# EasyEDA schematic 2025-10-27.json

## Sheets
1 Общая схема: TITLE: Общая схема; REV: 1.0; Date: 2025-10-27; Sheet: 1/1; Drawn By: corlov; Company: Орлов К.Л.
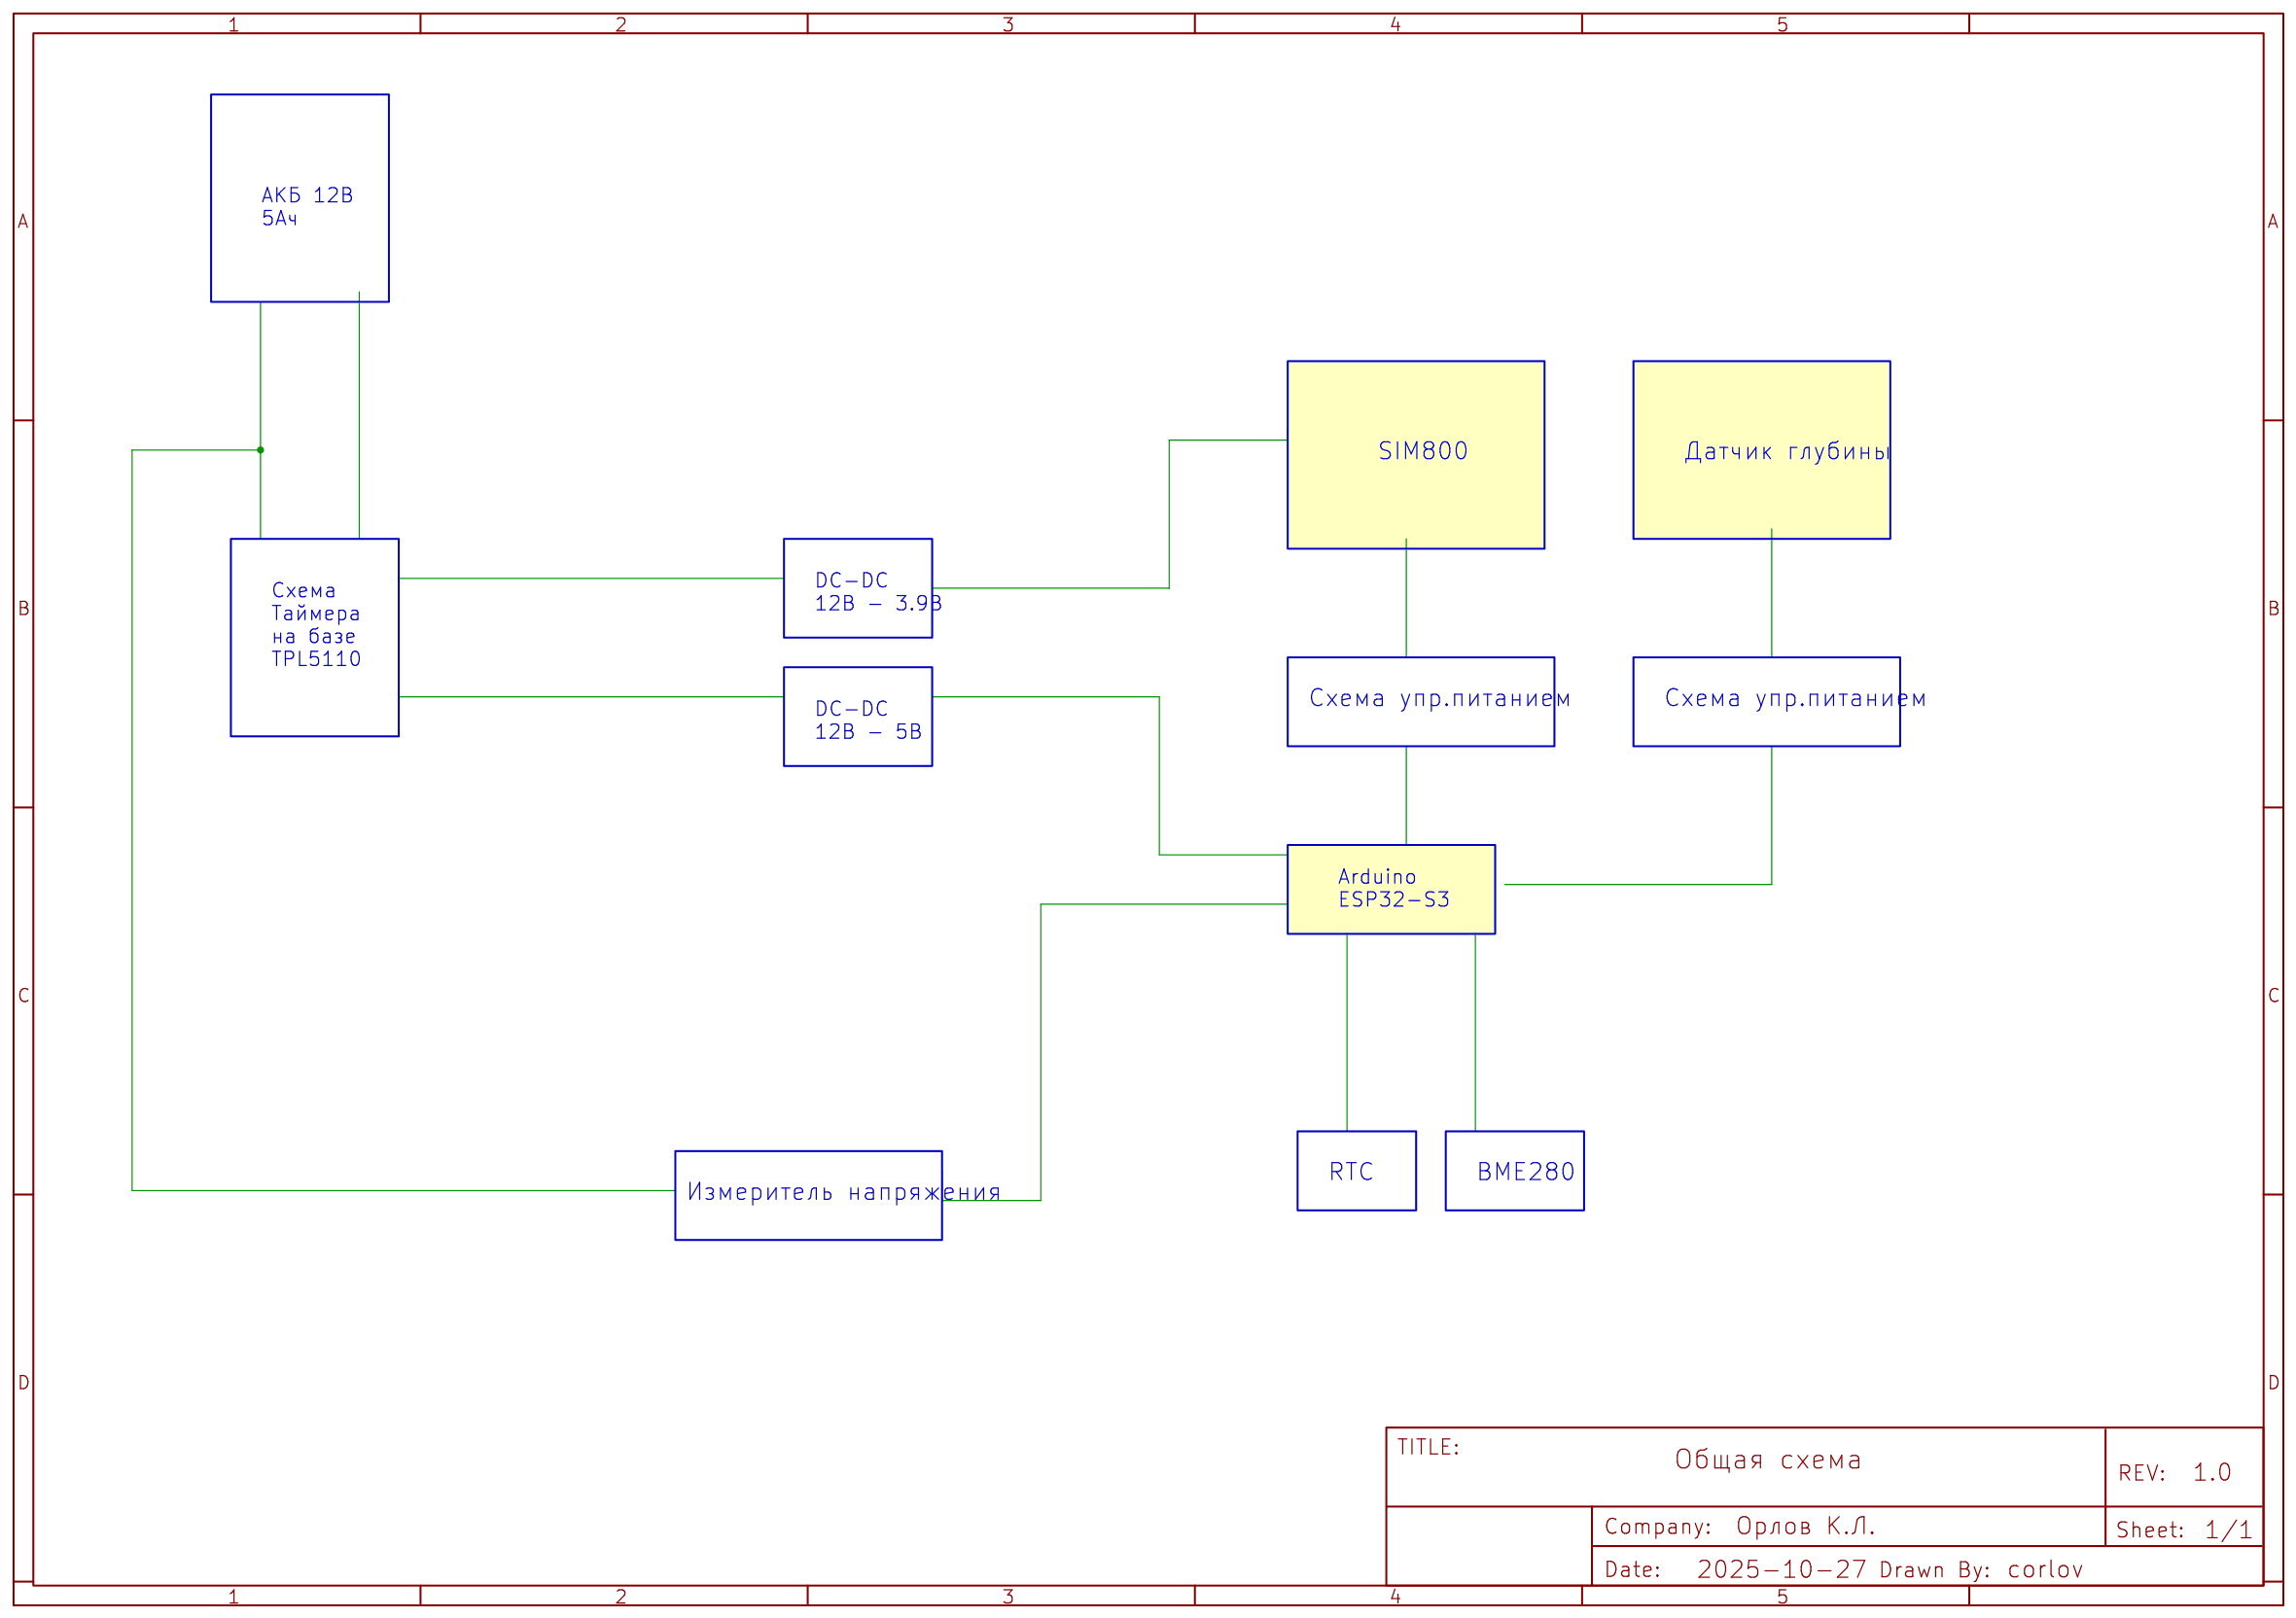
[diagram p0: Общая схема]
2 Питание по атймеру: TITLE: Управление питанием по таймеру; Company: Your Company
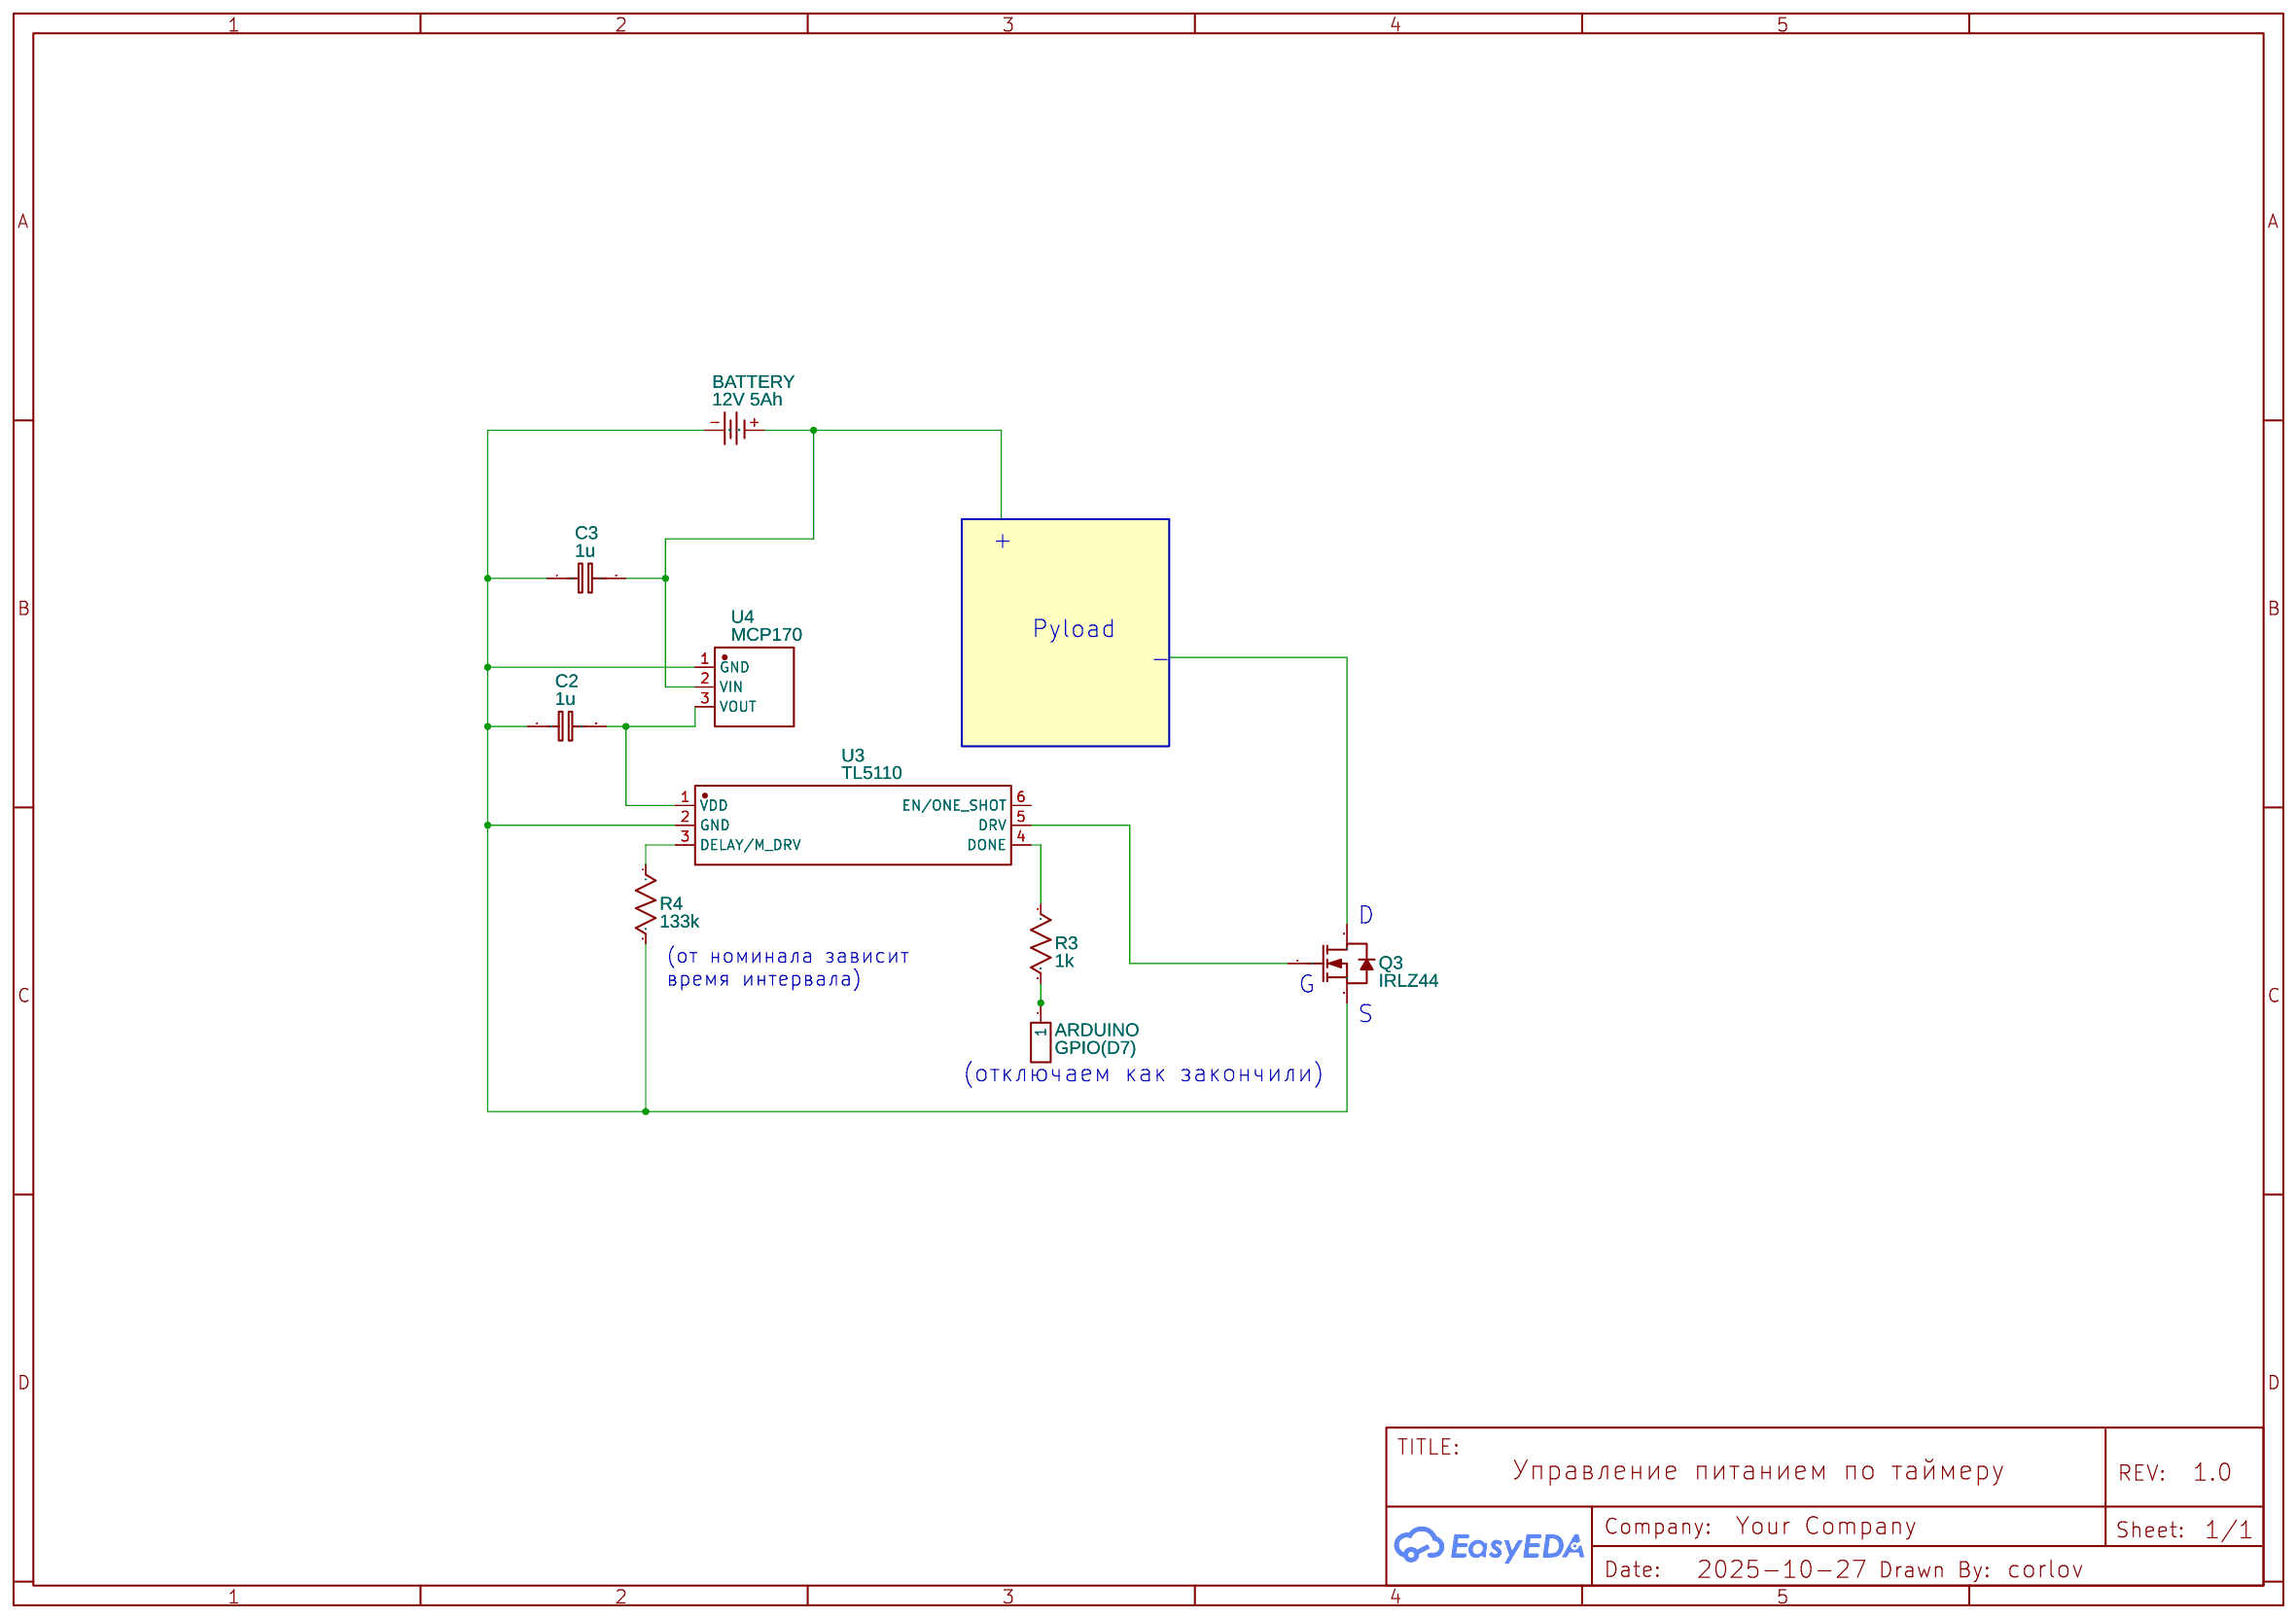
[diagram p1: Питание по атймеру]
3 PowerSwtich: TITLE: Упр. питанием модуля связи/аналоговым датчиком; Date: 2025-10-26; Company: Your Company
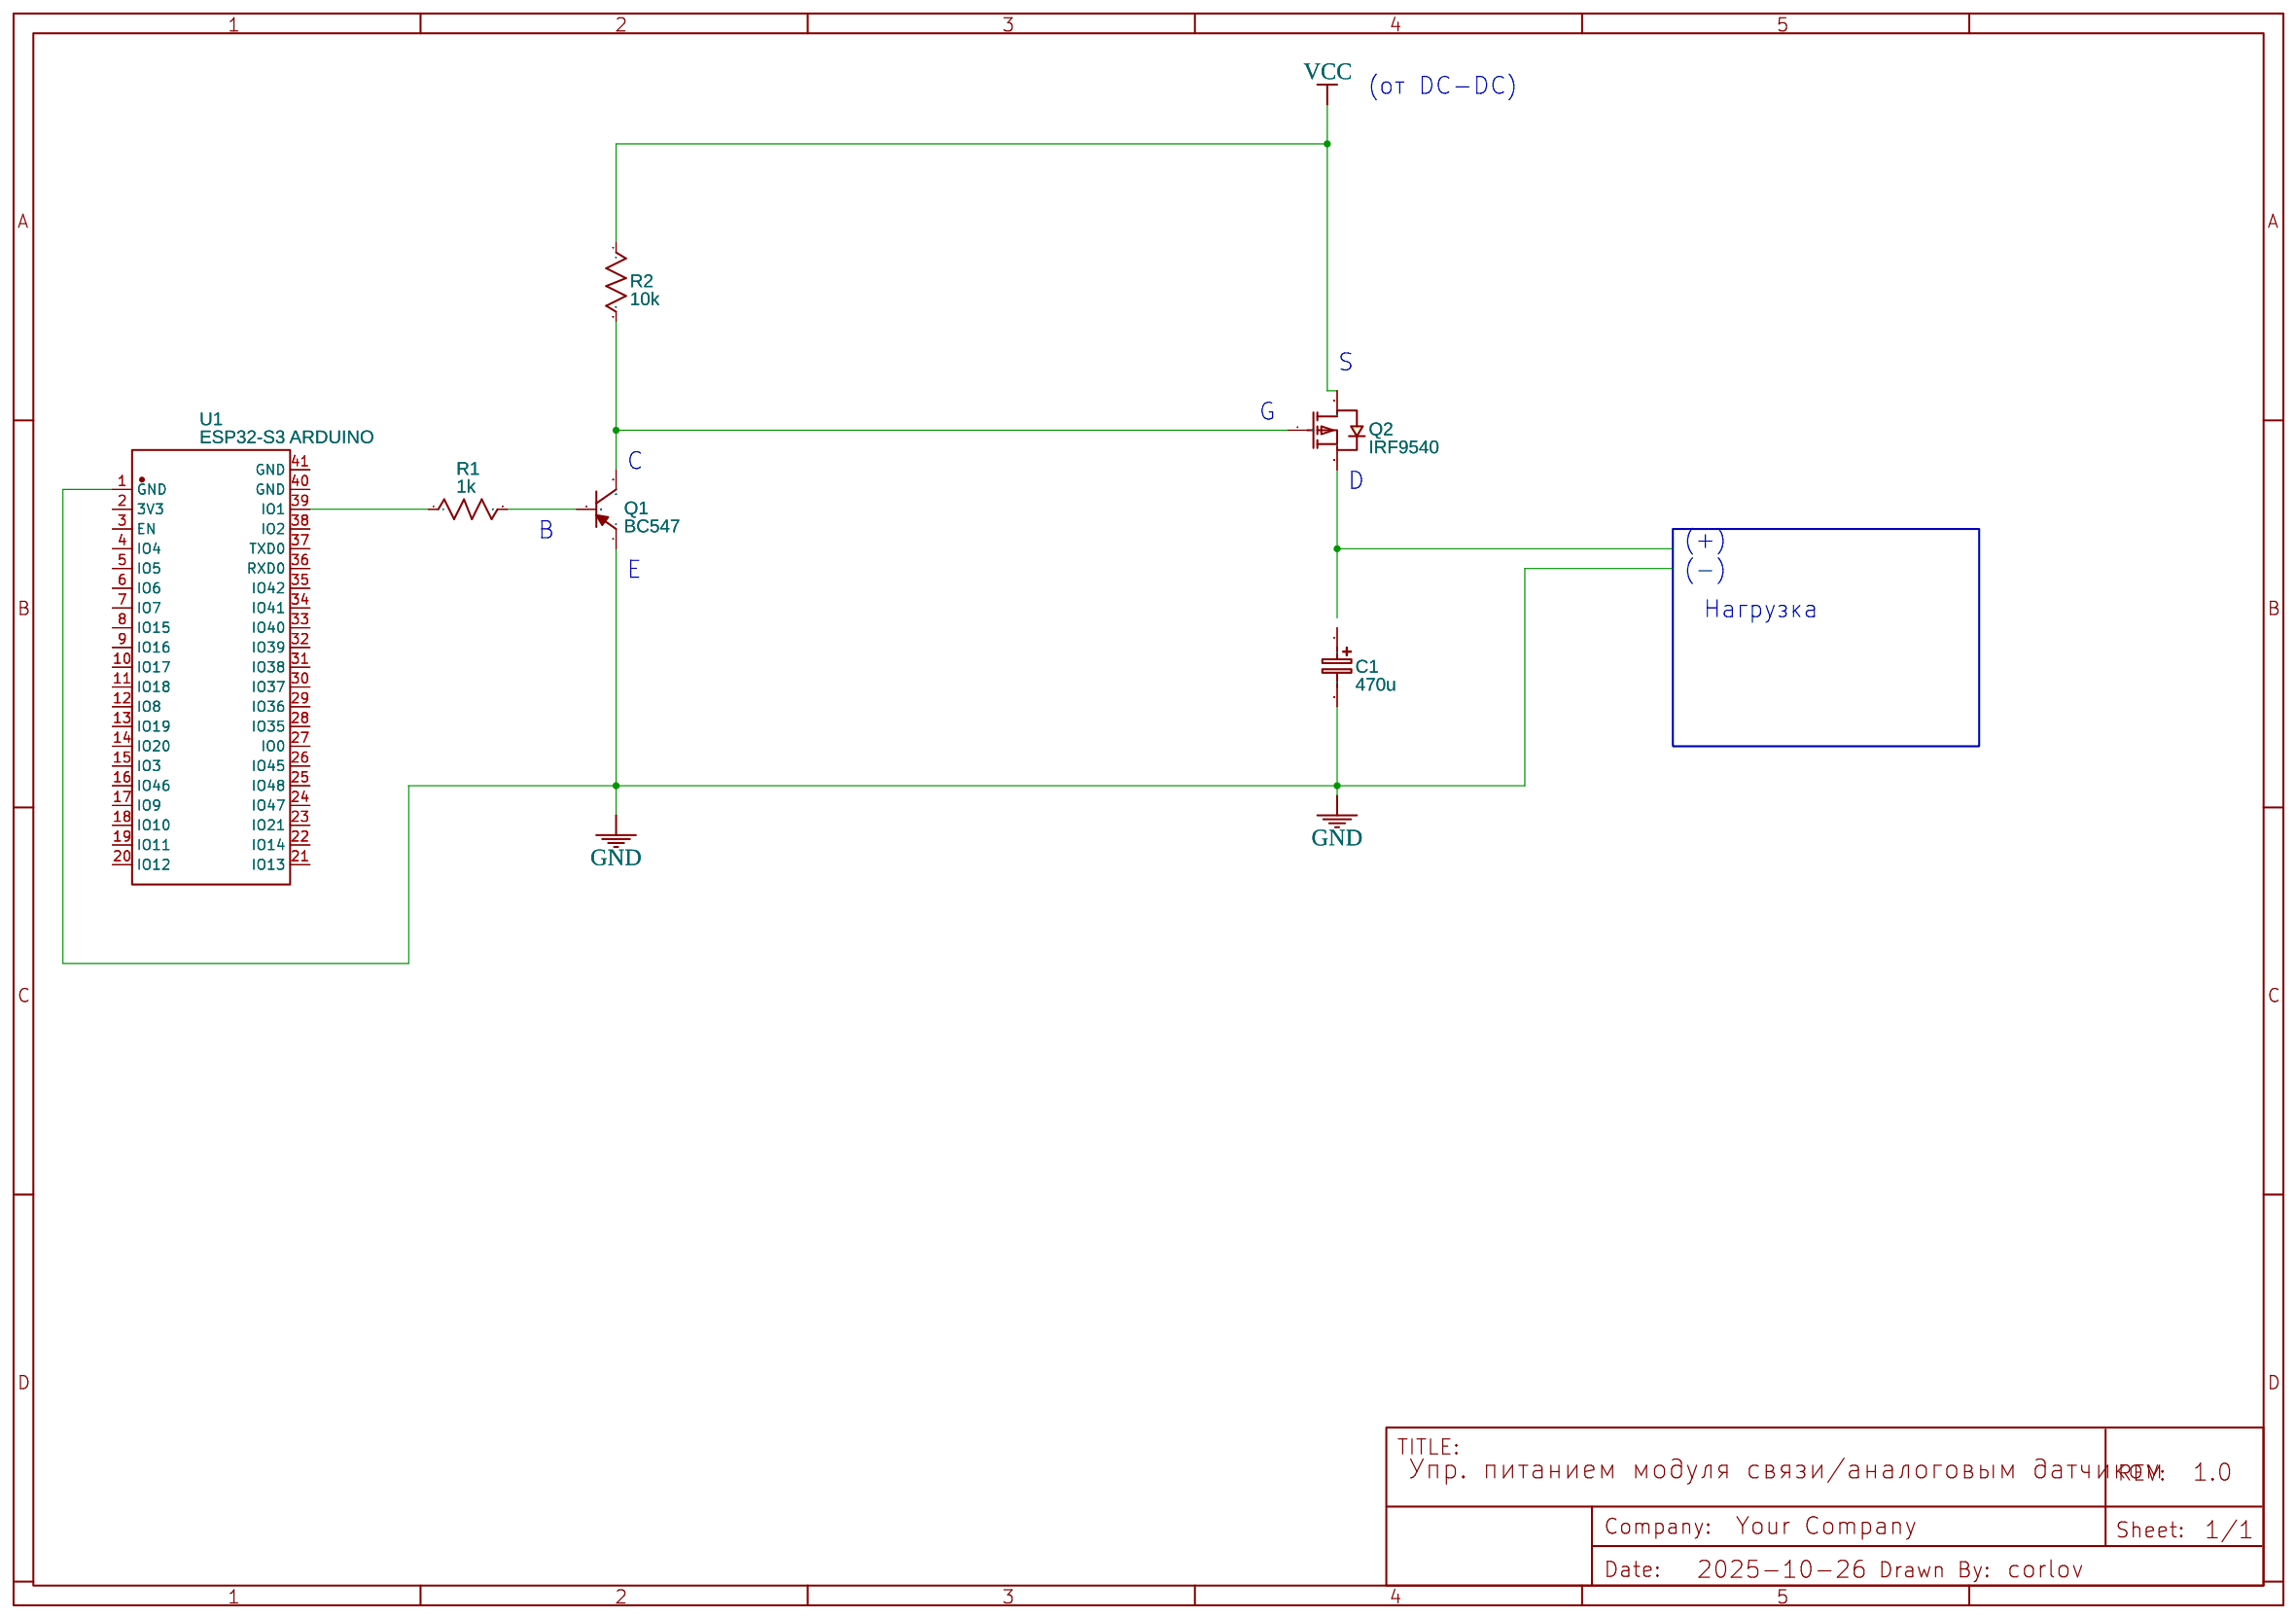
[diagram p2: PowerSwtich]
4 Отключаемый делитель: TITLE: Отключаемый полностью от питания делитель напряжения; Company: Орлов
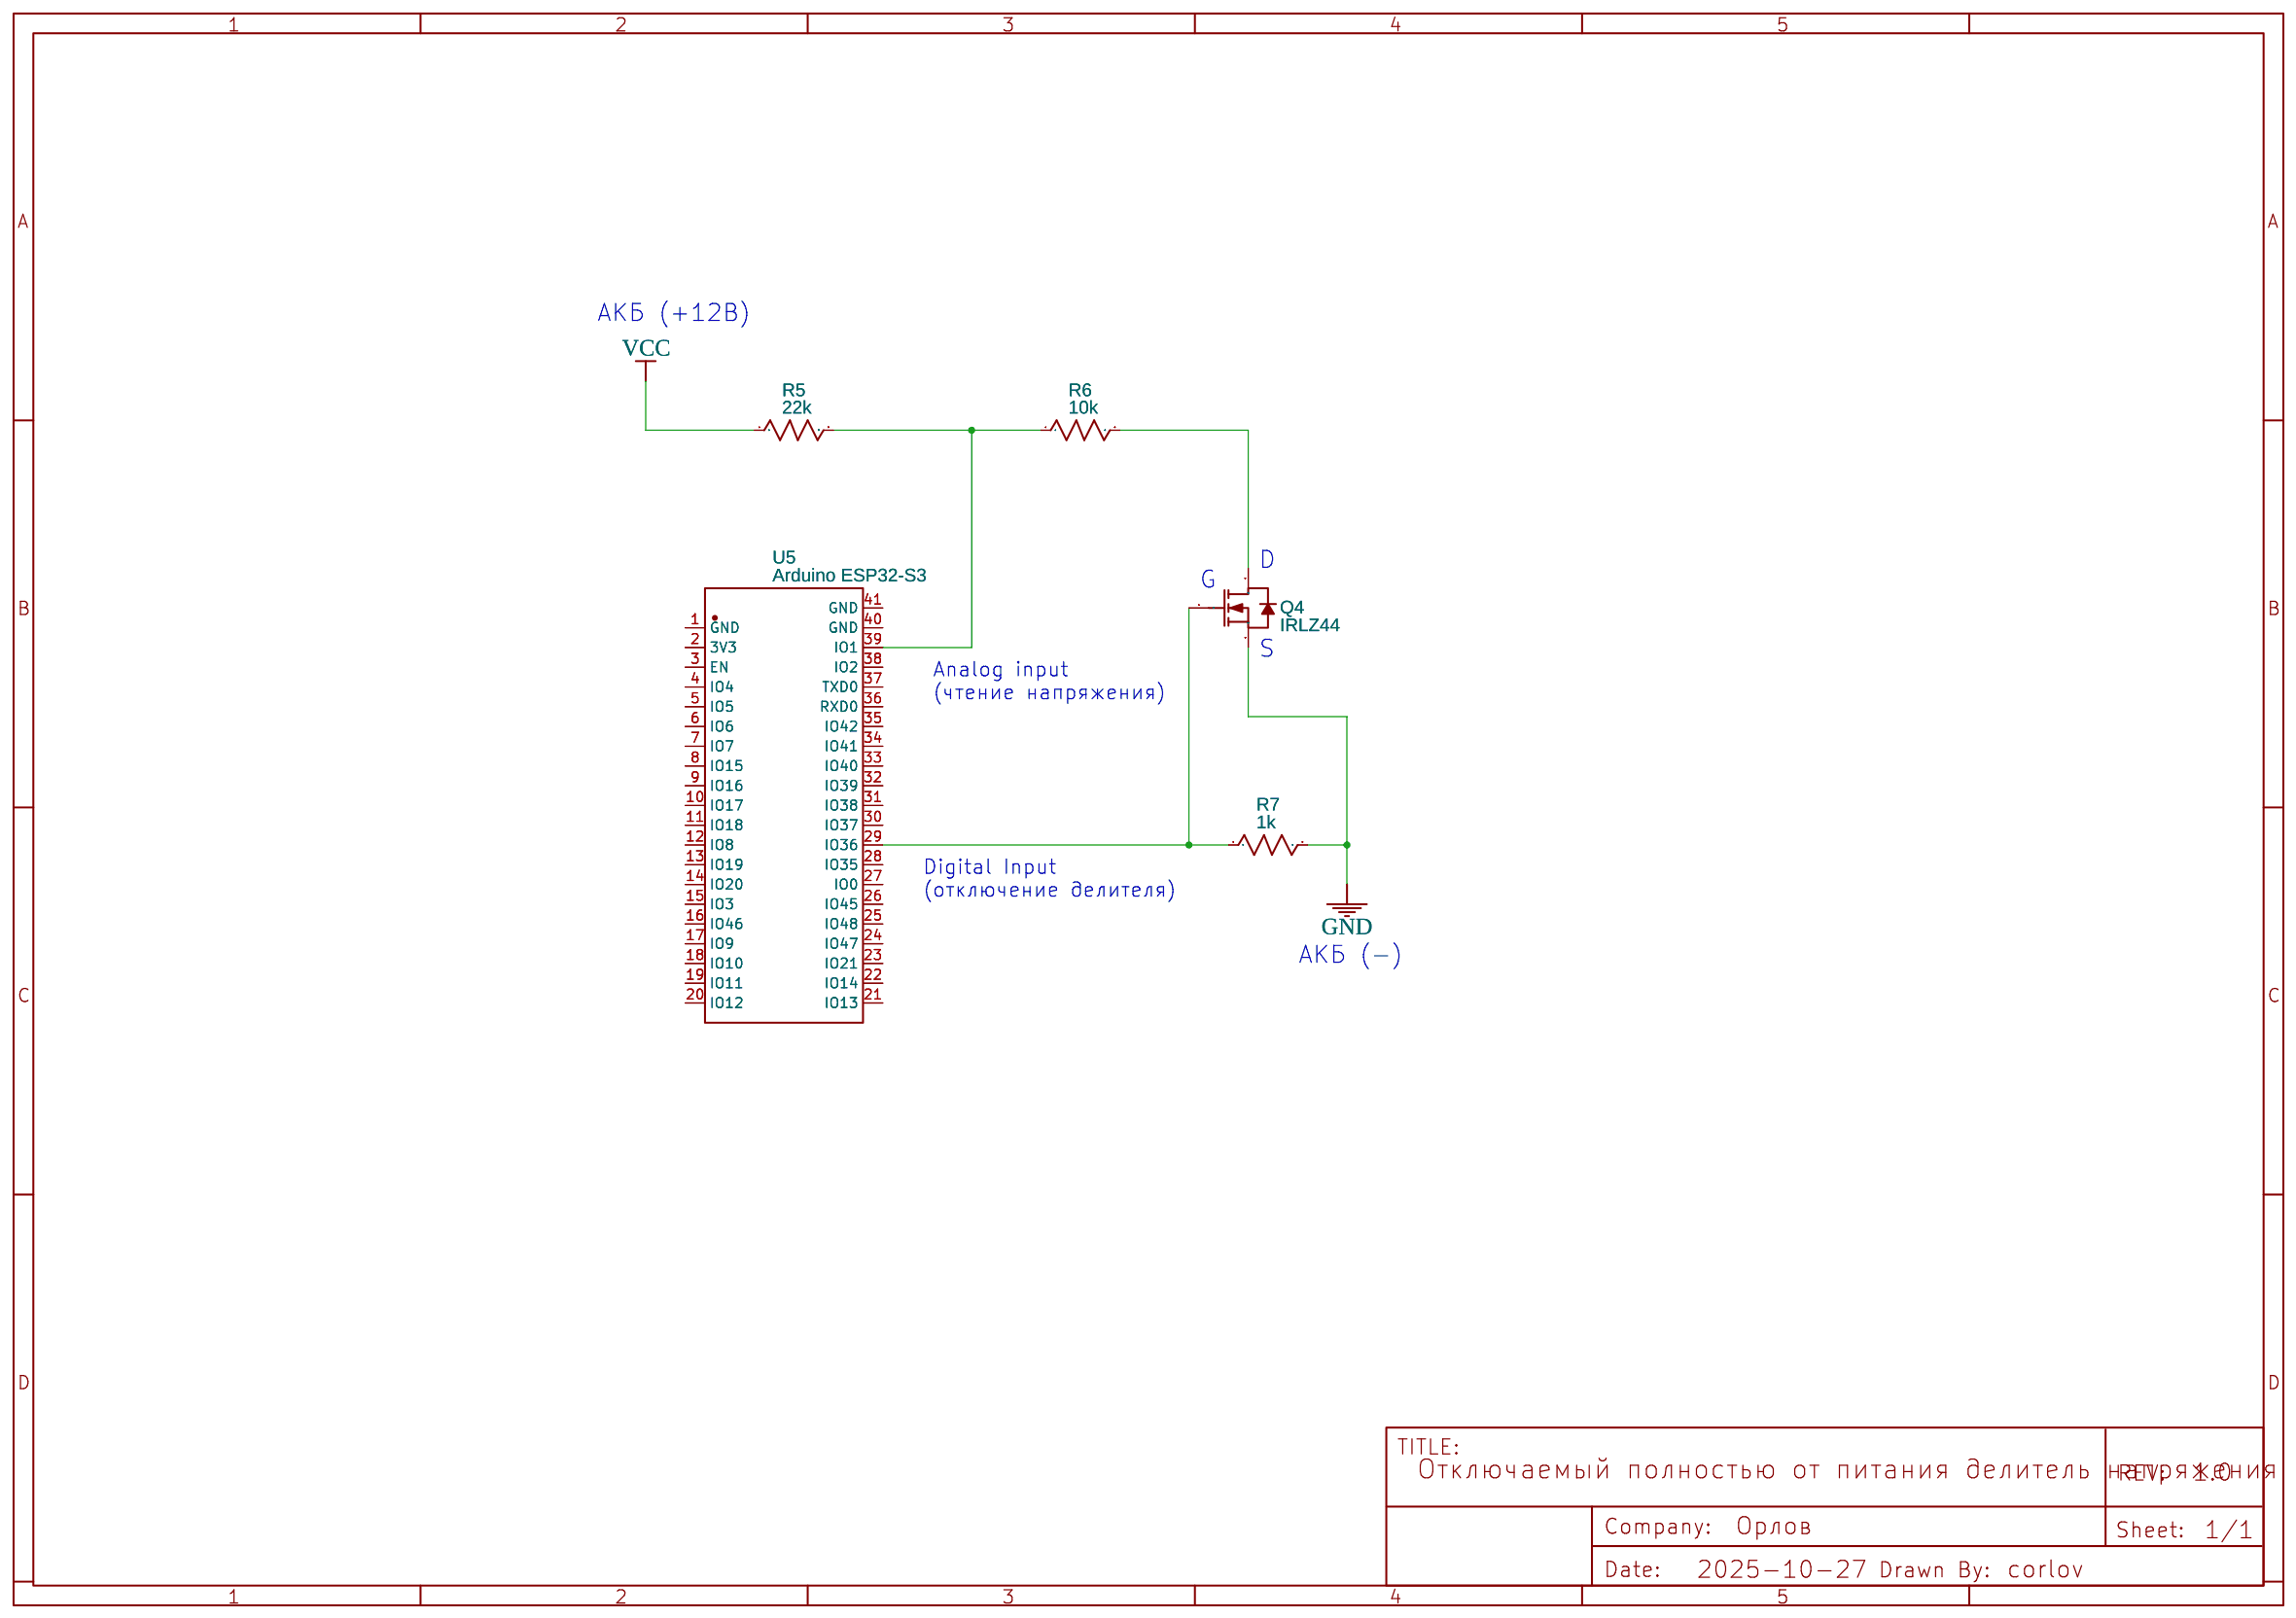
[diagram p3: Отключаемый делитель]

## Parts
sheet PowerSwtich
C1  470u  [CASE-A_3216]
Q1  BC547  [SOT-23-3_L2.9-W1.6-P1.90-LS2.8-TR-CW]
Q2  IRF9540  [TO-263-2_L10.0-W9.1-P5.08-LS15.2-BR]
R1  1k  [R0603]
R2  10k  [R0603]
U1  ESP32-S3 ARDUINO  [WIRELM-SMD_ESP32-S3-WROOM-1U]
sheet Отключаемый делитель
Q4  IRLZ44  [TO-220-3_L10.0-W4.5-P2.54-T]
R5  22k  [R0603]
R6  10k  [R0603]
R7  1k  [R0603]
U5  Arduino ESP32-S3  [WIRELM-SMD_ESP32-S3-WROOM-1U]
sheet Питание по атймеру
ARDUINO  GPIO(D7)  [HDR-M-2.54_1X1]
BATTERY  12V 5Ah  [BATTERY-SMD-MY-2032]
C2  1u  [C0603]
C3  1u  [C0603]
Q3  IRLZ44  [TO-220-3_L10.0-W4.5-P2.54-T]
R3  1k  [R0603]
R4  133k  [R0603]
U3  TL5110  [TSOT-23-6_L2.9-W1.6-P0.95-LS2.8-BR]
U4  MCP170  [SOT-89-3_L4.5-W2.4-P1.50-LS4.0-BR]

## Library data of the parts
C1 = C_Tan_SMD_A_EU: Contributor: LCEDA_Lib
Q1 = 2N3906(SOT-23): Supplier: LCSC; Manufacturer: KEC; Manufacturer Part: 2N3906S-RTK/PS; Contributor: LCEDA_Lib; Supplier Part: C147294
Q2 = IRF5210: Supplier: LCSC; Manufacturer: IR; Manufacturer Part: IRF5210STRLPBF; image: //image.lceda.cn/szlcsc/C2622.jpg; Supplier Part: C2622; Paste Type: expand; Contributor: LCEDA_Lib
R1-R7 = R_0603_US: Contributor: LCEDA_Lib
U1 U5 = ESP32-S3-WROOM-1U: Contributor: lcsc; Supplier: LCSC; Supplier Part: C9900027631; Manufacturer: null; JLCPCB Part Class: Extended Part
Q3 Q4 = IRLZ44NPBF: Supplier: LCSC; Manufacturer: Infineon(英飞凌); Supplier Part: C38774; JLCPCB Part Class: Extended Part
ARDUINO = HDR-M-2.54_1x1: Supplier Part: C81276; Supplier: LCSC; Contributor: LCEDA_Lib
BATTERY = MY-2032-10: Contributor: lcsc; Supplier: LCSC; Supplier Part: C964827; Manufacturer: MYOUNG(美阳); JLCPCB Part Class: Extended Part
C2 C3 = C_0603_EU: Contributor: LCEDA_Lib
U3 = TPL5110DDCR: Contributor: lcsc; Supplier: LCSC; Supplier Part: C2651358; Manufacturer: TI(德州仪器); JLCPCB Part Class: Extended Part
U4 = MCP1701AT-5002I/MB: Contributor: lcsc; Supplier: LCSC; Supplier Part: C556900; Manufacturer: MICROCHIP(美国微芯); JLCPCB Part Class: Extended Part

## Nets
GND: C1.2 Q1.1(E) Q4.3(S) R7.2 U1.1(GND)
VCC: Q2.4(D) R2.1 R5.1
Net-(ARDUINO-1): ARDUINO.1 R3.2
Net-(BATTERY-+): BATTERY.+(BAT-) C3.2 U4.2(VIN)
Net-(BATTERY--): BATTERY.-(BAT+) C2.1 C3.1 Q3.3(S) R4.2 U3.2(GND) U4.1(GND)
Net-(C2-2): C2.2 U3.1(VDD) U4.3(VOUT)
Net-(Q1-2): Q1.2(B) R1.2
Net-(Q1-3): Q1.3(C) Q2.1(G) R2.2
Net-(Q3-1): Q3.1(G) U3.5(DRV)
Net-(Q4-1): Q4.1(G) R7.1 U5.29(IO36)
Net-(Q4-2): Q4.2(D) R6.2
Net-(R1-1): R1.1 U1.39(IO1)
Net-(R3-1): R3.1 U3.4(DONE)
Net-(R4-1): R4.1 U3.3(DELAY/M_DRV)
Net-(R5-2): R5.2 R6.1 U5.39(IO1)

Not connected (* = marked no-connect by the designer): C1 1; Q2 3(S); Q3 2(D); U1 2(3V3) 3(EN) 4(IO4) 5(IO5) 6(IO6) 7(IO7) 8(IO15) 9(IO16) 10(IO17) 11(IO18) 12(IO8) 13(IO19) 14(IO20) 15(IO3) 16(IO46) 17(IO9) 18(IO10) 19(IO11) 20(IO12) 21(IO13) 22(IO14) 23(IO21) 24(IO47) 25(IO48) 26(IO45) 27(IO0) 28(IO35) 29(IO36) 30(IO37) 31(IO38) 32(IO39) 33(IO40) 34(IO41) 35(IO42) 36(RXD0) 37(TXD0) 38(IO2) 40(GND) 41(GND); U3 6(EN/ONE_SHOT); U5 1(GND) 2(3V3) 3(EN) 4(IO4) 5(IO5) 6(IO6) 7(IO7) 8(IO15) 9(IO16) 10(IO17) 11(IO18) 12(IO8) 13(IO19) 14(IO20) 15(IO3) 16(IO46) 17(IO9) 18(IO10) 19(IO11) 20(IO12) 21(IO13) 22(IO14) 23(IO21) 24(IO47) 25(IO48) 26(IO45) 27(IO0) 28(IO35) 30(IO37) 31(IO38) 32(IO39) 33(IO40) 34(IO41) 35(IO42) 36(RXD0) 37(TXD0) 38(IO2) 40(GND) 41(GND)

## Notes on the sheets
sheet 1
- АКБ 12В
  5Ач
- SIM800
- Датчик глубины
- Схема
  Таймера
  на базе
  TPL5110
- DC-DC
  12В - 3.9В
- DC-DC
  12В - 5В
- Схема упр.питанием
- Схема упр.питанием
- Arduino
  ESP32-S3
- RTC
- BME280
- Измеритель напряжения
sheet 2
- +
- Pyload
- -
- D
- (от номинала зависит
  время интервала)
- G
- S
- (отключаем как закончили)
sheet 3
- (от DC-DC)
- S
- G
- C
- D
- B
- (+)
- E
- (-)
- Нагрузка
sheet 4
- АКБ (+12В)
- D
- G
- S
- Analog input
  (чтение напряжения)
- Digital Input
  (отключение делителя)
- АКБ (-)
